# Altium schematic sheet Power.SchDoc
size A4; SheetNumber: 1; SheetTotal: 2
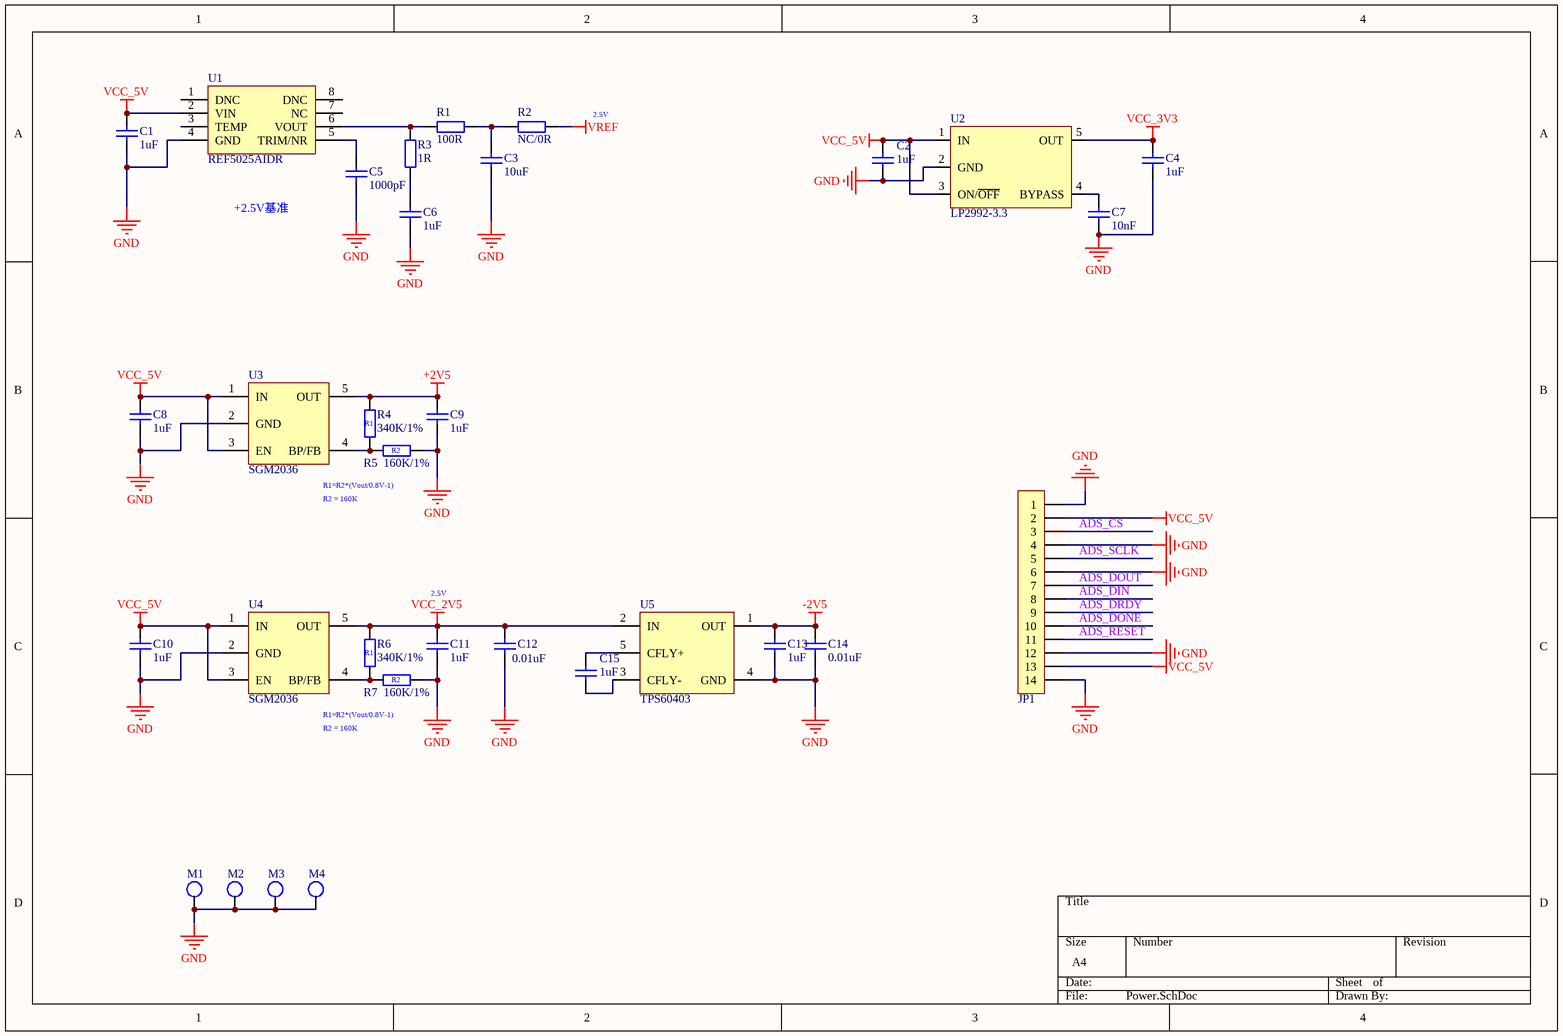
[diagram p0: Power.SchDoc]

## Parts
C1  1uF  [C0402_L]
C2  1uF  [C0402_L]
C3  10uF  [C0603_L]
C4  1uF  [C0402_L]
C5  1000pF  [C0402_L]
C6  1uF  [C0402_L]
C7  10nF  [C0402_L]
C8  1uF  [C0402_L]
C9  1uF  [C0402_L]
C10  1uF  [C0402_L]
C11  1uF  [C0402_L]
C12  0.01uF  [C0402_L]
C13  1uF  [C0402_L]
C14  0.01uF  [C0402_L]
C15  1uF  [C0402_L]
JP1  HDR-1X14  [FPC0.5-WT-14P]  (value not drawn)
M1  M2  [M2]  (value not drawn)
M2  M2  [M2]  (value not drawn)
M3  M2  [M2]  (value not drawn)
M4  M2  [M2]  (value not drawn)
R1  100R  [R0402_L]
R2  NC/0R  [R0402_L]
R3  1R  [R0402_L]
R4  340K/1%  [R0402_L]
R5  160K/1%  [R0402_L]
R6  340K/1%  [R0402_L]
R7  160K/1%  [R0402_L]
U1  REF5025AIDR  [SOIC-8L]
U2  LP2992-3.3  [SOT23-5L]
U3  SGM2036  [SOT23-5L]
U4  SGM2036  [SOT23-5L]
U5  TPS60403  [SOT23-5L]

## Nets
+2V5: C9.2 R4.2 U3.5(OUT)
-2V5: C13.2 C14.2 U5.1(OUT)
GND: C1.1 C2.1 C3.1 C4.1 C5.1 C6.1 C7.1 C8.1 C9.1 C10.1 C11.1 C12.1 C13.1 C14.1 JP1.1 JP1.4 JP1.6 JP1.12 JP1.14 M1.1 M2.1 M3.1 M4.1 R5.2 R7.2 U1.4(GND) U2.2(GND) U3.2(GND) U4.2(GND) U5.4(GND)
VCC_2V5: C11.2 C12.2 R6.2 U4.5(OUT) U5.2(IN)
VCC_3V3: C4.2 U2.5(OUT)
VCC_5V: C1.2 C2.2 C8.2 C10.2 JP1.2 JP1.13 U1.2(VIN) U2.1(IN) U2.3(ON/~{OFF}) U3.1(IN) U3.3(EN) U4.1(IN) U4.3(EN)
VREF: R2.2
ADS_CS: JP1.3
ADS_DIN: JP1.8
ADS_DONE: JP1.10
ADS_DOUT: JP1.7
ADS_DRDY: JP1.9
ADS_RESET: JP1.11
ADS_SCLK: JP1.5
NetC3_2: C3.2 R1.2 R2.1
NetC5_2: C5.2 U1.5(TRIM/NR)
NetC6_2: C6.2 R3.1
NetC7_2: C7.2 U2.4(BYPASS)
NetC15_1: C15.1 U5.3(CFLY-)
NetC15_2: C15.2 U5.5(CFLY+)
NetR1_1: R1.1 R3.2 U1.6(VOUT)
NetR4_1: R4.1 R5.1 U3.4(BP/FB)
NetR6_1: R6.1 R7.1 U4.4(BP/FB)

Not connected (* = marked no-connect by the designer): U1 1(DNC) 3(TEMP) 7(NC) 8(DNC)

## Notes on the sheet
- (near R2) 2.5V
- +2.5V基准
- (near R4) R1
- (near R5) R2
- R1=R2*(Vout/0.8V-1)
- R2 = 160K
- (near R6) R1
- (near C11) 2.5V
- (near R7) R2

## Library data of the parts
C1-C15 = C: 贴片电容; BOM名称: 无极性贴片电容; 联系卖家，免费查找封装: 唯一出售店铺网址https://shop463601444.taobao.com
JP1 = Header 14: 14P接插件; 封装库来自淘宝卖家 ID：黄晶宝石: 其他店铺购入均为盗版假冒封装库; 联系卖家，免费查找封装: 唯一出售店铺网址https://shop463601444.taobao.com; BOM名称: 14P接插件
M1-M4 = M2系列: M2孔支撑柱
R1-R7 = R: 贴片电阻; 联系卖家，免费查找封装: 唯一出售店铺网址https://shop463601444.taobao.com; BOM名称: 贴片电阻
U1 = REF5025AIDR: 3uVpp/V噪声 3ppm/℃漂移 电压基准 0.05%
U2 = LP2992
U3 U4 = SGM2036: 可调LDO
U5 = TPS6040x: 非稳压60mA电荷泵电压逆变器